# EAGLE schematic hv-surprise (EAGLE 7.2.0)
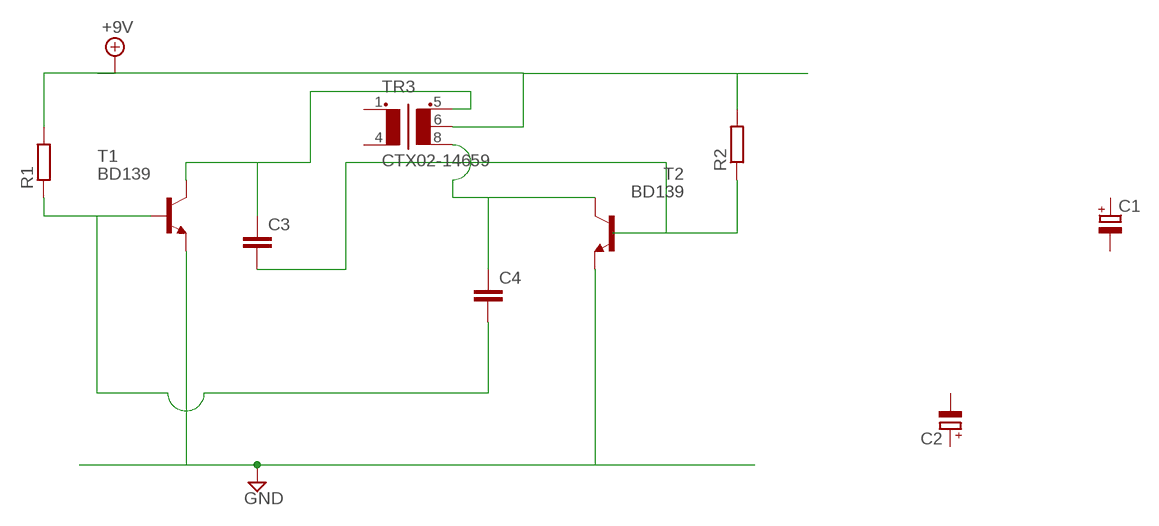
[diagram p0: schematic, sheet 1]

## Parts
C1  CPOL-EU153CLV-1010  [153CLV-1010]
C2  CPOL-EU153CLV-1010  [153CLV-1010]
C3  C-EU025-040X050  [C025-040X050]
C4  C-EU025-040X050  [C025-040X050]
R1  R-EU_0207/15  [0207/15]
R2  R-EU_0207/15  [0207/15]
T1  BD139  [TO126]
T2  BD139  [TO126]
TR3  CTX02-14659  [CTX02-14659]

## Nets
GND: T1.1(E) T2.1(E)
N$1: R1.2 R2.2 TR3.6
N$3: C4.2 R1.1 T1.3(B)
N$4: C3.1 T1.2(C) TR3.5
N$5: C3.2 R2.1
N$6: C4.1 T2.2(C) TR3.8
Unconnected: C1.+ C1.- C2.+ C2.- T2.3(B) TR3.1 TR3.4

## Library data of the parts
C1 C2 = resistor:CPOL-EU: POLARIZED CAPACITOR, European symbol
C3 C4 = resistor:C-EU: CAPACITOR, European symbol
R1 R2 = resistor:R-EU_: RESISTOR, European symbol
T1 T2 = transistor:BD139: NPN TRANSISTOR
TR3 = trafo:CTX02-14659: Transformer, Push-Pull 300kHz, 547uH, ER 9.5, SMT, gull wing, 8 pads Source: COOPERE ELECTRONIC TECHNOLOGIES .. ctx02-14659.pdf